# EAGLE design Advance_Dip_Chip (EAGLE 9.4.2)
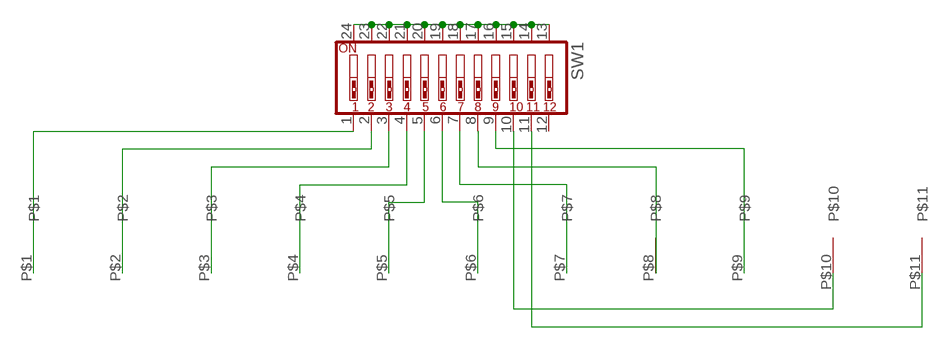
[diagram p0: schematic, sheet 1]

## Parts
SW1  SW_DIP-12  [EDG-12]
U$1  PINEDGE  [PINEDGE]

## Nets
N$1: SW1.13 SW1.14 SW1.15 SW1.16 SW1.17 SW1.18 SW1.19 SW1.20 SW1.21 SW1.22 SW1.23 SW1.24
N$2: SW1.1 U$1.P$1
N$3: SW1.2 U$1.P$2
N$4: SW1.3 U$1.P$3
N$5: SW1.4 U$1.P$4
N$6: SW1.5 U$1.P$5
N$7: SW1.6 U$1.P$6
N$8: SW1.7 U$1.P$7
N$9: SW1.8 U$1.P$8
N$10: SW1.9 U$1.P$9
N$11: SW1.10 U$1.P$10
N$12: SW1.11 U$1.P$11
Unconnected: SW1.12

## Library data of the parts
SW1 = special:SW_DIP-12: DIP SWITCH
U$1 = pinedge:PINEDGE

## Board
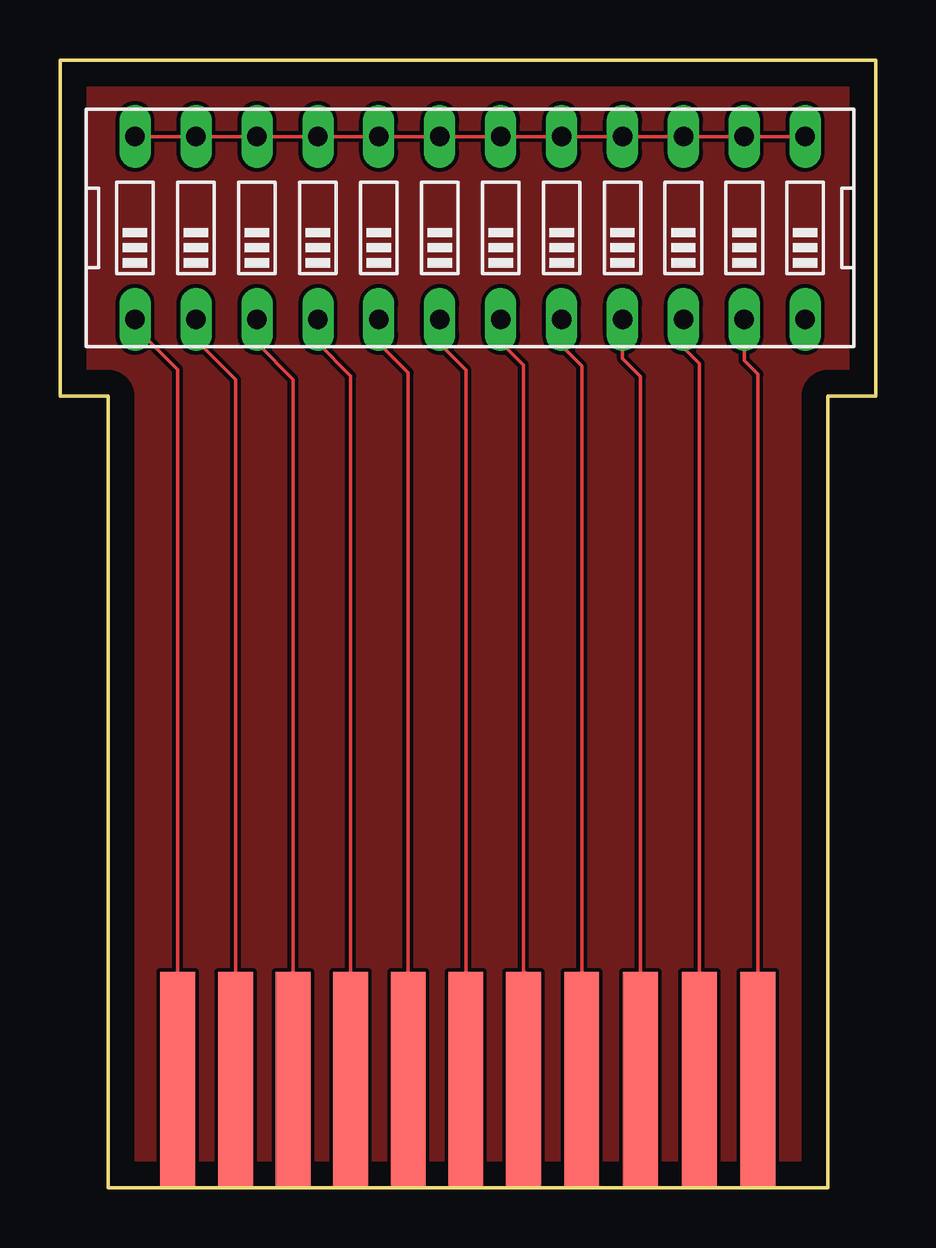
[diagram p1: board, top side]

Size 34 x 47 mm. Coordinates in mm from the lower left corner, seen from the top.
Outline: 2,47 0,47 0,33 2,33 2,0 32,0 32,33 34,33 34,47 1.85,47
Copper layers (1*16): Top 0.035mm / dielectric 1.5mm / Bottom 0.035mm
Design rules "default": minimum track width 6mil, minimum drill 0.35mm, track to track 6mil, track to pad 6mil, pad to pad 6mil, via to via 6mil, smd to smd 6mil, copper to edge 40mil, drill to drill 6mil, minimum pad ring 10mil, minimum via ring 8mil, stop-mask expansion 4mil, vias tented up to drill 0mil, thermal gap 10mil

### Footprints (pad centres in the part's own frame; a part is rotated, then mirrored left to right if it is on the bottom)
EDG-12 = drill 0.813 long: 1 -13.97,-3.81; 2 -11.43,-3.81; 3 -8.89,-3.81; 4 -6.35,-3.81; 5 -3.81,-3.81; 6 -1.27,-3.81; 7 1.27,-3.81; 8 3.81,-3.81; 9 6.35,-3.81; 10 8.89,-3.81; 11 11.43,-3.81; 12 13.97,-3.81; 13 13.97,3.81; 14 11.43,3.81; 15 8.89,3.81; 16 6.35,3.81; 17 3.81,3.81; 18 1.27,3.81; 19 -1.27,3.81; 20 -3.81,3.81; 21 -6.35,3.81; 22 -8.89,3.81; 23 -11.43,3.81; 24 -13.97,3.81
PINEDGE = smd 1.45 x 9: P$1 0.75,0.5; P$2 3.168,0.5; P$3 5.568,0.5; P$4 7.968,0.5; P$5 10.368,0.5; P$6 12.768,0.5; P$7 15.168,0.5; P$8 17.604,0.5; P$9 20.05,0.5; P$10 22.5,0.5; P$11 24.95,0.5

### Placement (x,y rotation side)
SW1  17.1,40 0 top
U$1  4.15,4 0 top

### Tracks (layer width: path | path; a pad name or v marks a point on that pad's centre or on a via)
GND
  pour Top: 2,0 2,47 32,47 32,0
  pour Top: 34,33 0,33 0,47 34,47
N$1
  Top 0.152: SW1.24 SW1.23 SW1.22 SW1.21 SW1.20 SW1.19 SW1.18 SW1.17 SW1.16 SW1.15 SW1.13 SW1.14
N$2
  Top 0.152: 4.88,4.52 U$1.P$1 4.9,34.1 3.13,35.87 SW1.1
N$3
  Top 0.152: U$1.P$2 7.32,33.68 5.67,35.33 SW1.2
N$4
  Top 0.152: U$1.P$3 9.72,33.68 8.21,35.19 SW1.3
N$5
  Top 0.152: U$1.P$4 12.12,33.82 10.75,35.19 SW1.4
N$6
  Top 0.152: U$1.P$5 14.52,33.96 13.29,35.19 SW1.5
N$7
  Top 0.152: 17,4.6 U$1.P$6 16.92,34.08 15.83,35.17 SW1.6
N$8
  Top 0.152: 19.37,9 19.32,9 U$1.P$7 19.32,34.28 18.37,35.23 SW1.7
N$9
  Top 0.152: U$1.P$8 21.75,34.25 20.91,35.09 SW1.8
N$10
  Top 0.152: U$1.P$9 24.2,33.8 23.45,34.55 SW1.9
N$11
  Top 0.152: U$1.P$10 26.65,34.35 25.99,35.01 SW1.10
N$12
  Top 0.152: U$1.P$11 29.1,33.9 28.53,34.47 SW1.11